# EAGLE design OptoInputs (EAGLE 7.2.0)
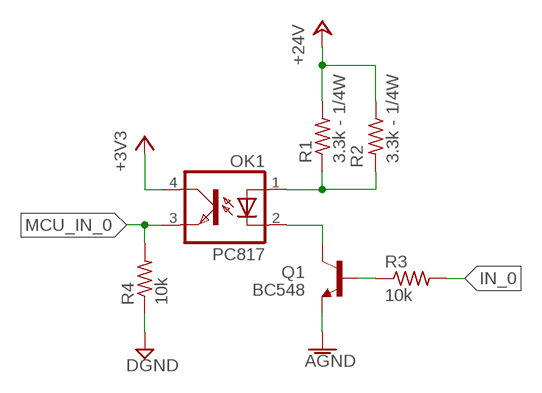
[diagram p0: schematic, sheet 1]

## Parts
OK1  PC817  [DIL04]
Q1  BC548  [TO92-EBC]
R1  3.3k - 1/4W  R-US_0204/2V  [0204V]
R2  3.3k - 1/4W  R-US_0204/2V  [0204V]
R3  10k  R-US_0204/5  [0204/5]
R4  10k  R-US_R0402  [R0402]

## Nets
+3V3: OK1.4(COL)
+24V: R1.2 R2.1
AGND: Q1.E
DGND: R4.1
IN_0: R3.2
MCU_IN_0: OK1.3(EMIT) R4.2
N$1: OK1.1(A) R1.1 R2.2
N$4: OK1.2(C) Q1.C
N$5: Q1.B R3.1

## Library data of the parts
OK1 = optocoupler:PC817: SHARP OPTO COUPLER; MPN: PC817X4J000F; OC_FARNELL: 9707727; OC_NEWARK: 97K7059
Q1 = transistor-npn:BC548*: NPN Transistor
R1-R4 = rcl:R-US_: RESISTOR, American symbol

## Board
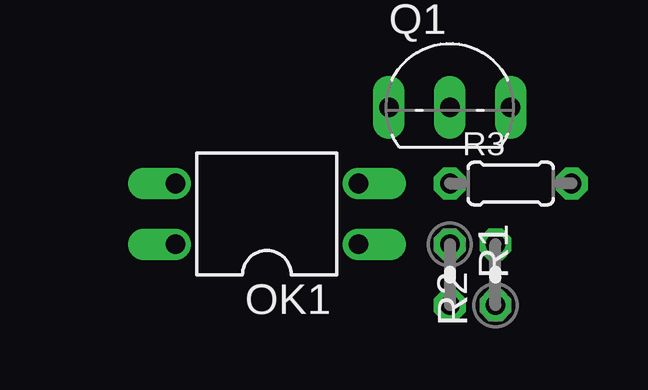
[diagram p1: board, top side]
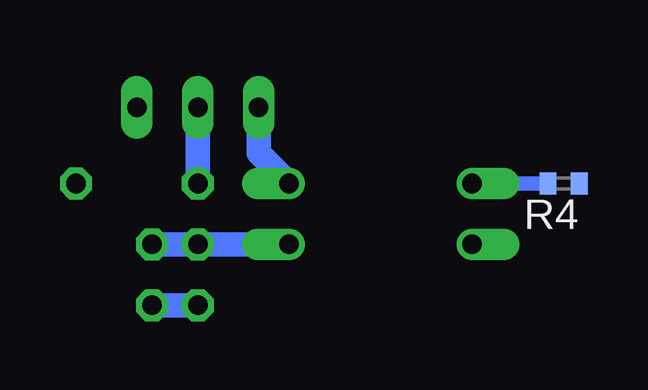
[diagram p2: board, bottom side, seen from below]

No outline drawn. Coordinates in mm, seen from the top.
Copper layers (1*16): Top 0.035mm / dielectric 1.5mm / Bottom 0.035mm
Design rules "default": minimum track width 10mil, minimum drill 24mil, track to track 8mil, track to pad 8mil, pad to pad 8mil, via to via 8mil, smd to smd 8mil, copper to edge 40mil, drill to drill 8mil, minimum pad ring 10mil, minimum via ring 8mil, stop-mask expansion 4mil, vias tented up to drill 0mil, thermal gap 10mil

### Footprints (pad centres in the part's own frame; a part is rotated, then mirrored left to right if it is on the bottom)
DIL04 = drill 0.813 offset: 1 -1.27,-3.81; 2 1.27,-3.81; 3 1.27,3.81; 4 -1.27,3.81
TO92-EBC = drill 0.813 long: B 0,-1.27; C -2.54,-1.27; E 2.54,-1.27
0204V = drill 0.813 octagon: 1 -1.27,0; 2 1.27,0
0204/5 = drill 0.813 octagon: 1 -2.54,0; 2 2.54,0
R0402 = smd 0.7 x 0.9: 1 -0.65,0; 2 0.65,0

### Placement (x,y rotation side)
OK1  0,0 90 top
Q1  7.62,5.71 0 top
R1  7.62,-2.54 270 top
R2  9.53,-2.54 90 top
R3  10.16,1.27 0 top
R4  -7.62,1.27 180 bottom

### Tracks (layer width: path | path; a pad name or v marks a point on that pad's centre or on a via)
+24V
  Bottom 1.016: R2.1 R1.2
MCU_IN_0
  Bottom 0.61: R4.2 OK1.3
N$1
  Bottom 1.016: OK1.1 R1.1 R2.2
N$4
  Bottom 1.016: OK1.2 5.08,2.54 Q1.C
N$5
  Bottom 1.016: Q1.B R3.1